# EasyEDA schematic JBCBJSchem.json
TITLE: JBCBJ; REV: 7; Date: 2020-04-20; Sheet: 1/1; Drawn By: SSSI; Company: SSSI
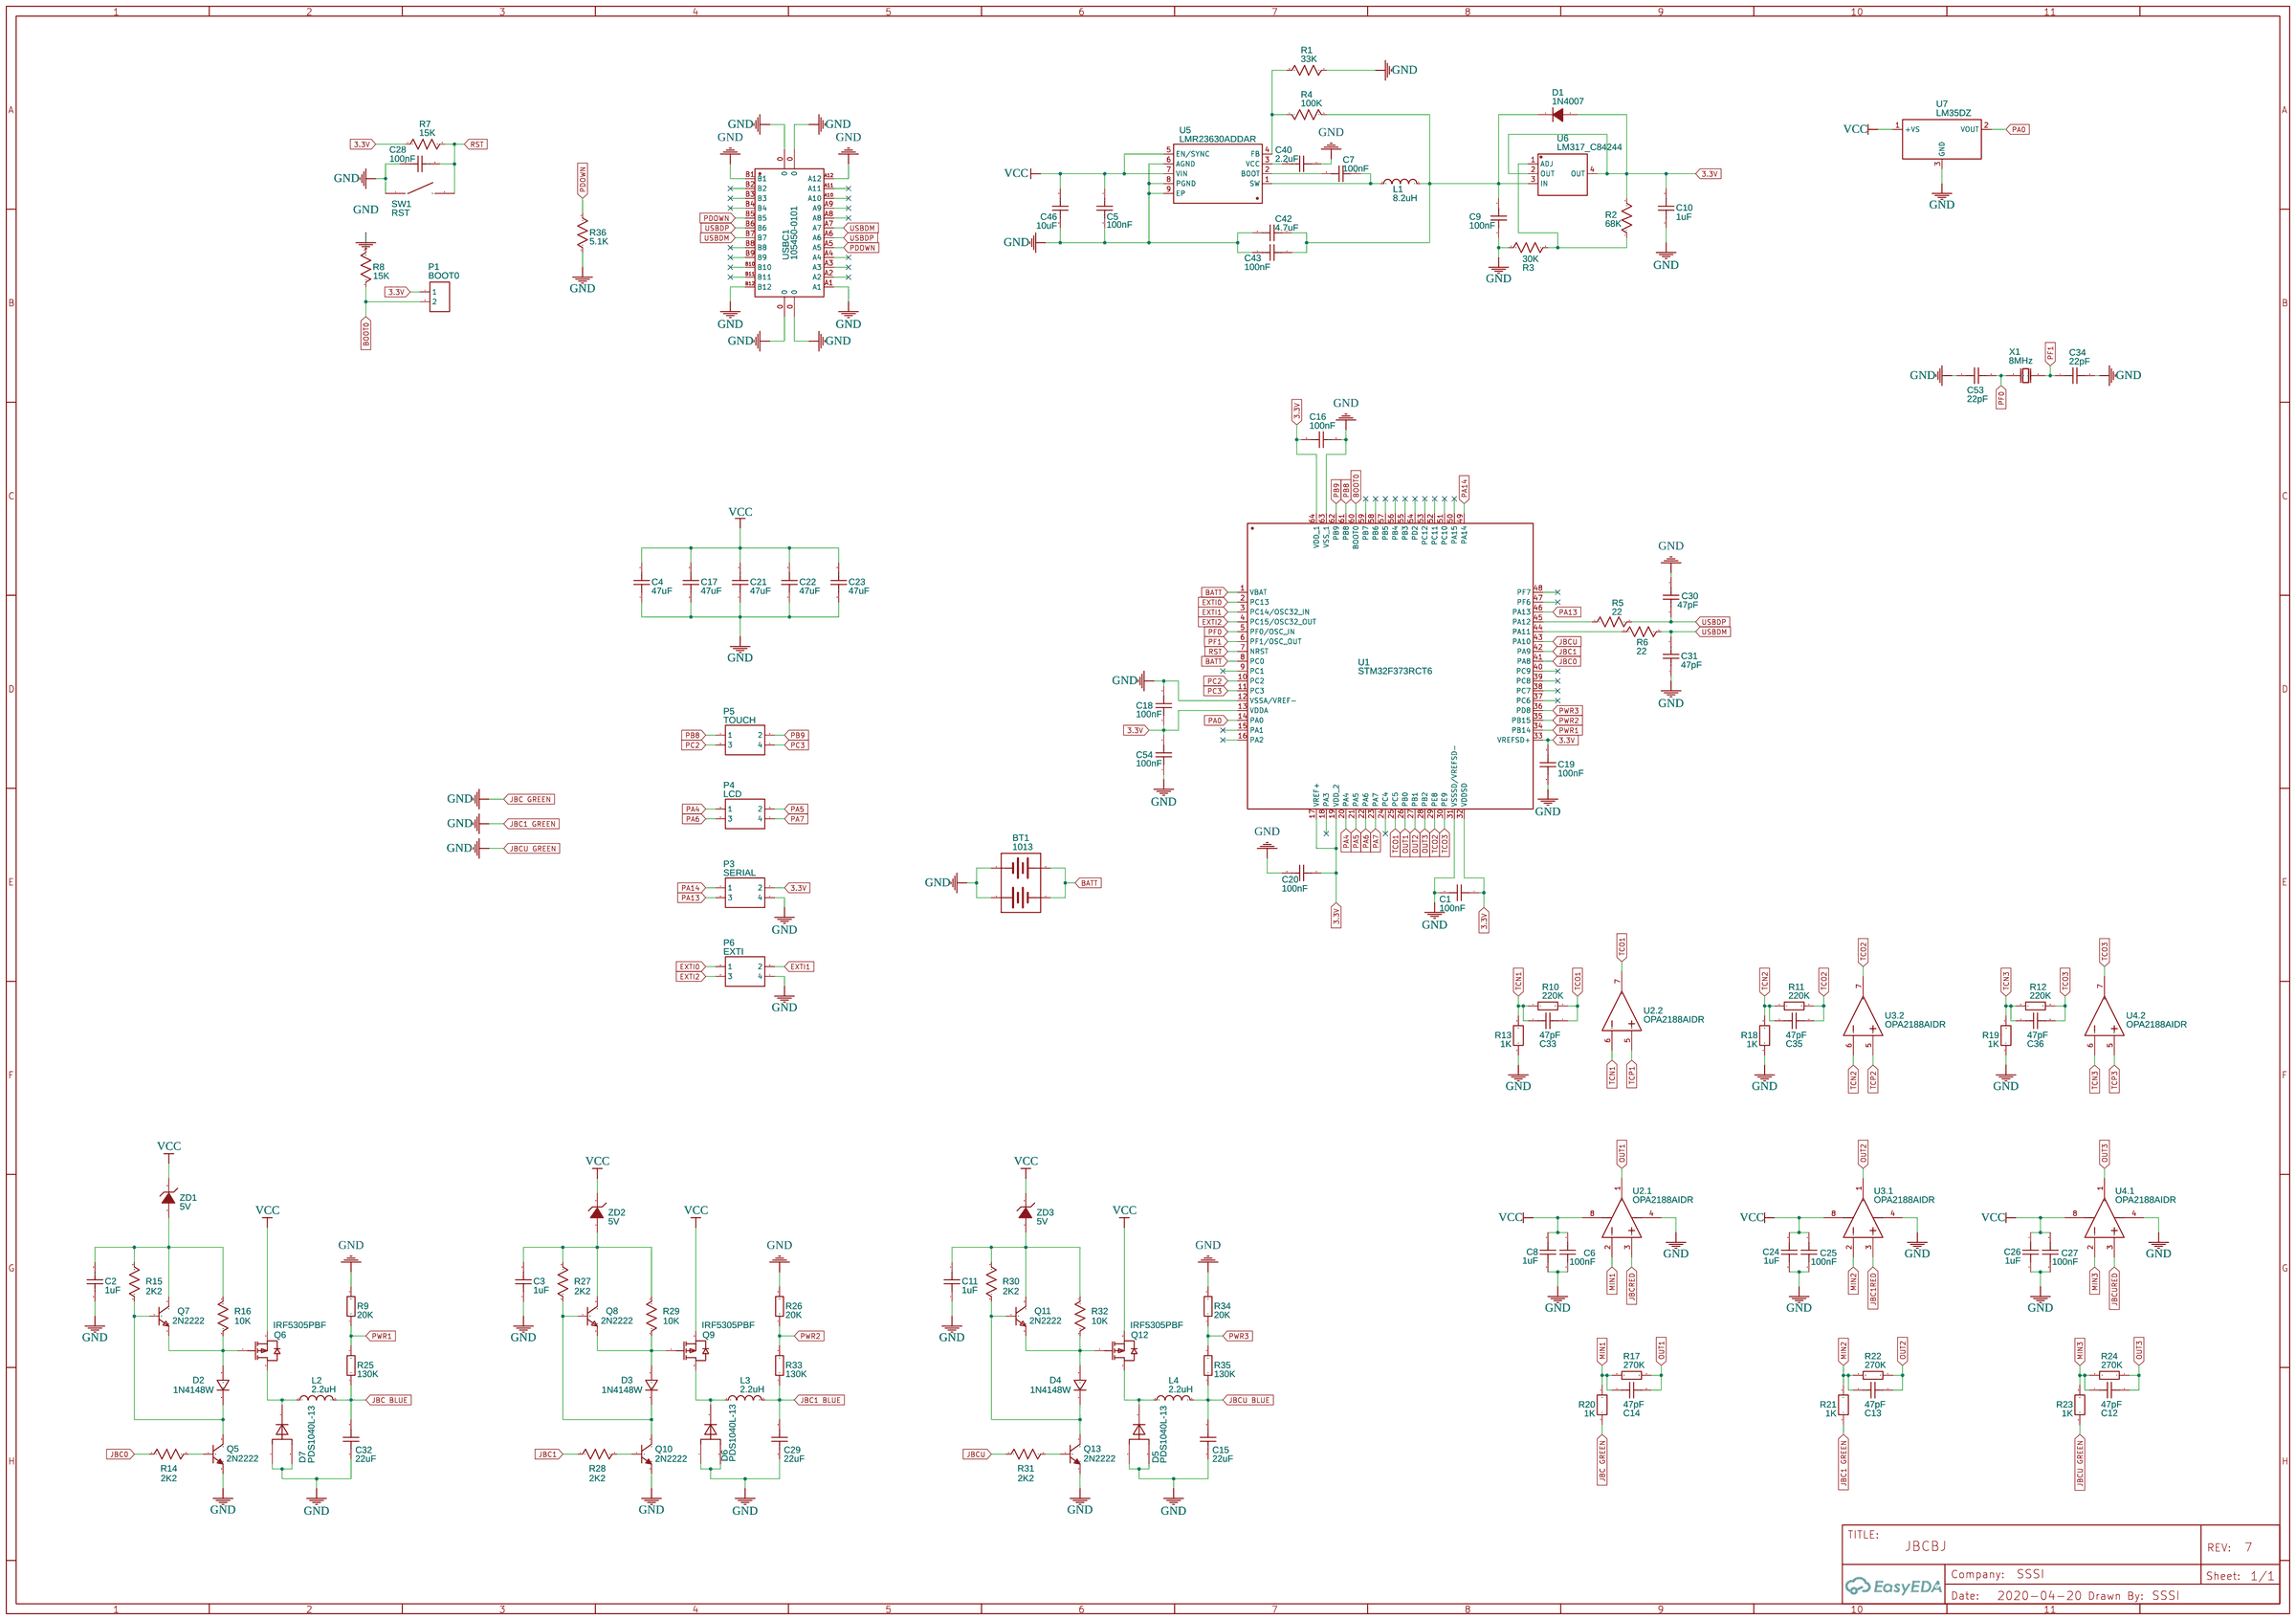
[diagram p0: schematic sheet]

## Parts
BT1  1013  [BAT-TH_KEYSTONE-1013]
C1  100nF  [C0603]
C2  1uF  [C0603]
C3  1uF  [C0603]
C4  47uF  [C1206]
C5  100nF  [C0603]
C6  100nF  [C0603]
C7  100nF  [C0603]
C8  1uF  [C0603]
C9  100nF  [C0603]
C10  1uF  [C0603]
C11  1uF  [C0603]
C12  47pF  [C0603]
C13  47pF  [C0603]
C14  47pF  [C0603]
C15  22uF  [C1206]
C16  100nF  [C0603]
C17  47uF  [C1206]
C18  100nF  [C0603]
C19  100nF  [C0603]
C20  100nF  [C0603]
C21  47uF  [C1206]
C22  47uF  [C1206]
C23  47uF  [C1206]
C24  1uF  [C0603]
C25  100nF  [C0603]
C26  1uF  [C0603]
C27  100nF  [C0603]
C28  100nF  [C0603]
C29  22uF  [C1206]
C30  47pF  [C0603]
C31  47pF  [C0603]
C32  22uF  [C1206]
C33  47pF  [C0603]
C34  22pF  [C0603]
C35  47pF  [C0603]
C36  47pF  [C0603]
C40  2.2uF  [C0603]
C42  4.7uF  [C0603]
C43  100nF  [C0603]
C46  10uF  [C0603]
C53  22pF  [C0603]
C54  100nF  [C0603]
D1  1N4007  [DO-214BA_L4.8-W2.9-LS5.3-RD]
D2  1N4148W  [SOD-323F_L2.0-W1.6-LS2.5-RD]
D3  1N4148W  [SOD-323F_L2.0-W1.6-LS2.5-RD]
D4  1N4148W  [SOD-323F_L2.0-W1.6-LS2.5-RD]
D5  PDS1040L-13  [POWERDI-5_L5.4-W4.0-LS6.5-RD]
D6  PDS1040L-13  [POWERDI-5_L5.4-W4.0-LS6.5-RD]
D7  PDS1040L-13  [POWERDI-5_L5.4-W4.0-LS6.5-RD]
L1  8.2uH  [IND-SMD_L7.8-W7.0_MAPM0630F]
L2  2.2uH  [IND-SMD_L6.6-W6.6_MCW-06XX]
L3  2.2uH  [IND-SMD_L6.6-W6.6_MCW-06XX]
L4  2.2uH  [IND-SMD_L6.6-W6.6_MCW-06XX]
P1  BOOT0  [HDR-TH_2P-P2.54-V-M]
P3  SERIAL  [HDR-TH_4PIN-V-ROW2-COL2-MALE-PITCH2.54]
P4  LCD  [HDR-TH_4PIN-V-ROW2-COL2-MALE-PITCH2.54]
P5  TOUCH  [HDR-TH_4PIN-V-ROW2-COL2-MALE-PITCH2.54]
P6  EXTI  [HDR-TH_4PIN-V-ROW2-COL2-MALE-PITCH2.54]
Q5  2N2222  [SOT-23-3_L2.9-W1.3-P1.90-LS2.4-BR]
Q6  IRF5305PBF  [DPAK-3_L6.6-W6.1-P2.28-LS9.9-BR]
Q7  2N2222  [SOT-23-3_L2.9-W1.3-P1.90-LS2.4-BR]
Q8  2N2222  [SOT-23-3_L2.9-W1.3-P1.90-LS2.4-BR]
Q9  IRF5305PBF  [DPAK-3_L6.6-W6.1-P2.28-LS9.9-BR]
Q10  2N2222  [SOT-23-3_L2.9-W1.3-P1.90-LS2.4-BR]
Q11  2N2222  [SOT-23-3_L2.9-W1.3-P1.90-LS2.4-BR]
Q12  IRF5305PBF  [DPAK-3_L6.6-W6.1-P2.28-LS9.9-BR]
Q13  2N2222  [SOT-23-3_L2.9-W1.3-P1.90-LS2.4-BR]
R1  33K  [R0603]
R2  68K  [R0603]
R3  30K  [R0603]
R4  100K  [R0603]
R5  22  [R0603]
R6  22  [R0603]
R7  15K  [R0603]
R8  15K  [R0603]
R9  20K  [R0603]
R10  220K  [R0603]
R11  220K  [R0603]
R12  220K  [R0603]
R13  1K  [R0603]
R14  2K2  [R0603]
R15  2K2  [R0603]
R16  10K  [R0603]
R17  270K  [R0603]
R18  1K  [R0603]
R19  1K  [R0603]
R20  1K  [R0603]
R21  1K  [R0603]
R22  270K  [R0603]
R23  1K  [R0603]
R24  270K  [R0603]
R25  130K  [R0603]
R26  20K  [R0603]
R27  2K2  [R0603]
R28  2K2  [R0603]
R29  10K  [R0603]
R30  2K2  [R0603]
R31  2K2  [R0603]
R32  10K  [R0603]
R33  130K  [R0603]
R34  20K  [R0603]
R35  130K  [R0603]
R36  5.1K  [R0603]
SW1  RST  [KEY-6.0*6.0-4]
U1  STM32F373RCT6  [LQFP-64_L10.0-W10.0-P0.50-LS12.0-TL]
U2  OPA2188AIDR  [SOIC-8_L4.9-W3.9-P1.27-LS6.0-BL]  (sections 1,2)
U3  OPA2188AIDR  [SOIC-8_L4.9-W3.9-P1.27-LS6.0-BL]  (sections 1,2)
U4  OPA2188AIDR  [SOIC-8_L4.9-W3.9-P1.27-LS6.0-BL]  (sections 1,2)
U5  LMR23630ADDAR  [SO-8_L4.9-W3.9-P1.27-LS6.0-BL-EP]
U6  LM317_C84244  [SOT-223-3_L6.5-W3.4-P2.30-LS7.0-BR]
U7  LM35DZ  [TO-92-3_L4.9-W3.7-P1.27-L]
USBC1  105450-0101  [USB-C-SMD_TYPE-C-USB-18]
X1  8MHz  [HC-49US_L11.5-W4.5-P4.88]
ZD1  5V  [VERTICAL DO41 DIODE]
ZD2  5V  [VERTICAL DO41 DIODE]
ZD3  5V  [VERTICAL DO41 DIODE]

## Library data of the parts
BT1 = 1013: Supplier: LCSC; Supplier Part: C238059; Manufacturer: Keystone; Contributor: LCSC
C1 C5-C10 C12-C14 C16 C18-C20 C24-C28 C30 C31 C33-C36 C40 C42 C43 C46 C53 C54 = Cap_RAD-0.1_US
C2-C4 C11 C17 C21-C23 = C_0201_US: Contributor: LCEDA_Lib
C15 C29 C32 = C3216X5R1V226MTJ00E: Supplier: LCSC; Supplier Part: C342620; Manufacturer: TDK; Contributor: LCSC
D1 = 1N4007: Supplier: LCSC; Manufacturer: SEMTECH; Supplier Part: C106903
D2-D4 = 1N4148W: Supplier: LCSC; Manufacturer: Tak Cheong; Contributor: LCEDA_Lib; Supplier Part: C129216
D5-D7 = PDS1040L-13: Supplier Part: C154714; Supplier: LCSC; Manufacturer: DIODES; Contributor: LCSC
L1 = MAPM0630F-8R2M-LF: Supplier: LCSC; Supplier Part: C280926; Manufacturer: microgate; Contributor: LCSC
L2-L4 = MCW-0630-2R2-S1: Supplier: LCSC; Manufacturer: Hk-hotline; Contributor: LCSC; Supplier Part: C169317
P1 = Header-Female-2.54_1x2: Supplier: LCSC; Manufacturer: BOOMELE; Manufacturer Part: 2.54-1*2PFemale; image: //image.lceda.cn/szlcsc/C49661.jpg; Supplier Part: C49661
P3-P6 = Header-Male-2.54_2x2: Supplier: LCSC; Manufacturer: BOOMELE; Manufacturer Part: Double Rows2.54mm2*2pHeaders  Pins; Supplier Part: C66690
Q5 Q10 Q13 = 2N3904: Supplier: LCSC; Manufacturer: SEMTECH; Supplier Part: C118538
Q6 Q9 Q12 = IRF5305PBF: Supplier: LCSC; Manufacturer: IR; image: //image.lceda.cn/szlcsc/C2623.jpg; Supplier Part: C2623
Q7 Q8 Q11 = 2N2222: Supplier: LCSC; Manufacturer: SEMTECH; Contributor: LCSC; Supplier Part: C118536
R1-R8 R16 R29 R32 R36 = Res_AXIAL-0.3(1/8W)_US
R9 R26 R34 = ERA-3AEB203V: Supplier: LCSC; Supplier Part: C190611; Manufacturer: PANASONIC; Contributor: LCSC
R10-R12 = PTFR0603B220KP9: Supplier: LCSC; Supplier Part: C351667; Manufacturer: ResistorToday; Contributor: LCSC
R13 R18-R21 R23 = PTFR0603B1K00N9: Supplier: LCSC; Supplier Part: C394536; Manufacturer: ResistorToday; Contributor: LCSC
R14 R15 R27 R28 R30 R31 = R_0201_US: Contributor: LCEDA_Lib
R17 R22 R24 = PTFR0805B270KN9: Supplier: LCSC; Supplier Part: C351588; Manufacturer: ResistorToday; Contributor: LCSC
R25 R33 R35 = PTFR0603B130KP9: Supplier: LCSC; Supplier Part: C351684; Manufacturer: ResistorToday; Contributor: LCSC
SW1 = EVQ22705R: Supplier: LCSC; Manufacturer: PANASONIC; Contributor: LCSC; Supplier Part: C79156
U1 = STM32F373RCT6: Supplier: LCSC; Manufacturer: STMicroelectronics; Supplier Part: C84174; LCSC Assembly: Yes; SMT Type: Extend
U2-U4 = OPA2188AIDR: tags: Precision Operational Amplifier; Supplier Part: C17271; Supplier: LCSC; Manufacturer: TI; subpart_no: 1; image: http://image.lceda.cn/szlcsc/C17271.jpg
U5 = LMR23630ADDAR: Supplier: LCSC; Supplier Part: C477923; Manufacturer: Texas Instruments; Contributor: LCSC
U6 = LM317_C84244: Supplier: LCSC; Manufacturer: CJ; Manufacturer Part: LM317; Supplier Part: C84244; LCSC Assembly: Yes; SMT Type: Extend
U7 = LM35DZ: Supplier: LCSC; Manufacturer: TI; image: //image.lceda.cn/szlcsc/C12165.jpg; Supplier Part: C12165
USBC1 = 105450-0101: Supplier: LCSC; Supplier Part: C134092; Manufacturer: MOLEX; Contributor: LCSC
X1 = X49SD8MSB2SI: Supplier: LCSC; Supplier Part: C188205; Manufacturer: Yangxing Tech; Contributor: LCSC
ZD1-ZD3 = BZX84C5V1: Supplier: LCSC; Manufacturer: CJ; image: //image.lceda.cn/szlcsc/C27131.jpg; Supplier Part: C27131; LCSC Assembly: Yes; SMT Type: Extend

## Nets
3.3V: C1.1 C10.2 C16.1 C18.1 C19.1 C20.1 C54.2 D1.2(A) P1.1 P3.2 R2.2 R7.1 U1.13(VDDA) U1.17(VREF+) U1.19(VDD_2) U1.32(VDDSD) U1.33(VREFSD+) U1.64(VDD_1) U6.2(OUT) U6.4(OUT)
GND: BT1.1(P1) BT1.4(N2) C1.2 C2.1 C3.1 C4.1 C5.2 C6.2 C8.2 C9.1 C10.1 C11.1 C15.1 C16.2 C17.1 C18.2 C19.2 C20.2 C21.1 C22.1 C23.1 C24.2 C25.2 C26.2 C27.2 C28.1 C29.1 C30.1 C31.1 C32.1 C34.2 C40.1 C42.2 C43.2 C46.2 C53.1 C54.1 D5.1 D5.2 D6.1 D6.2 D7.1 D7.2 P3.4 P6.4 Q5.2(E) Q10.2(E) Q13.2(E) R1.1 R3.2 R8.2 R9.2 R13.1 R18.1 R19.1 R20.1 R21.1 R23.1 R26.2 R34.2 R36.1 SW1.1 U1.12(VSSA/VREF-) U1.31(VSSSD/VREFSD-) U1.63(VSS_1) U2.4(V-) U3.4(V-) U4.4(V-) U5.6(AGND) U5.8(PGND) U5.9(EP) U7.3(GND) USBC1.0 USBC1.A1 USBC1.A12 USBC1.B1 USBC1.B12
VCC: C4.2 C5.1 C6.1 C8.1 C17.2 C21.2 C22.2 C23.2 C24.1 C25.1 C26.1 C27.1 C46.1 Q6.3(S) Q9.3(S) Q12.3(S) U2.8(V+) U3.8(V+) U4.8(V+) U5.5(EN/SYNC) U5.7(VIN) U7.1(+VS) ZD1.2(K) ZD2.2(K) ZD3.2(K)
BATT: BT1.2(N1) BT1.3(P2) U1.1(VBAT) U1.8(PC0)
BOOT0: P1.2 R8.1 U1.60(BOOT0)
EXTI0: P6.1 U1.2(PC13)
EXTI1: P6.2 U1.3(PC14/OSC32_IN)
EXTI2: P6.3 U1.4(PC15/OSC32_OUT)
JBC0: R14.1 U1.41(PA8)
JBC1: R28.1 U1.42(PA9)
JBC1 BLUE: C29.2 L3.2 R33.1
JBC1RED: U3.3(IN A+)
JBC BLUE: C32.2 L2.2 R25.1
JBCRED: U2.3(IN A+)
JBCU: R31.1 U1.43(PA10)
JBCU BLUE: C15.2 L4.2 R35.1
JBCURED: U4.3(IN A+)
MIN1: C14.1 R17.2 R20.2 U2.2(IN A-)
MIN2: C13.1 R21.2 R22.2 U3.2(IN A-)
MIN3: C12.1 R23.2 R24.2 U4.2(IN A-)
OUT1: C14.2 R17.1 U1.26(PB0) U2.1(OUT A)
OUT2: C13.2 R22.1 U1.27(PB1) U3.1(OUT A)
OUT3: C12.2 R24.1 U1.28(PB2) U4.1(OUT A)
PA0: U1.14(PA0) U7.2(VOUT)
PA4: P4.1 U1.20(PA4)
PA5: P4.2 U1.21(PA5)
PA6: P4.3 U1.22(PA6)
PA7: P4.4 U1.23(PA7)
PA13: P3.3 U1.46(PA13)
PA14: P3.1 U1.49(PA14)
PB8: P5.1 U1.61(PB8)
PB9: P5.2 U1.62(PB9)
PC2: P5.3 U1.10(PC2)
PC3: P5.4 U1.11(PC3)
PDOWN: R36.2 USBC1.A5 USBC1.B5
PF0: C53.2 U1.5(PF0/OSC_IN) X1.1(OSC1)
PF1: C34.1 U1.6(PF1/OSC_OUT) X1.2(OSC2)
PWR1: R9.1 R25.2 U1.34(PB14)
PWR2: R26.1 R33.2 U1.35(PB15)
PWR3: R34.1 R35.2 U1.36(PD8)
RST: C28.2 R7.2 SW1.2 U1.7(NRST)
TCN1: C33.1 R10.1 R13.2 U2.6(IN B-)
TCN2: C35.1 R11.1 R18.2 U3.6(IN B-)
TCN3: C36.1 R12.1 R19.2 U4.6(IN B-)
TCO1: C33.2 R10.2 U1.25(PC5) U2.7(OUT B)
TCO2: C35.2 R11.2 U1.29(PE8) U3.7(OUT B)
TCO3: C36.2 R12.2 U1.30(PE9) U4.7(OUT B)
TCP1: U2.5(IN B+)
TCP2: U3.5(IN B+)
TCP3: U4.5(IN B+)
USBDM: C31.2 R6.2 USBC1.A7 USBC1.B7
USBDP: C30.2 R5.2 USBC1.A6 USBC1.B6
Net-(C2-2): C2.2 Q7.3(C) R15.2 R16.1 ZD1.1(A)
Net-(C3-2): C3.2 Q8.3(C) R27.2 R29.1 ZD2.1(A)
Net-(C7-1): C7.1 L1.2 U5.1(SW)
Net-(C7-2): C7.2 U5.2(BOOT)
Net-(C9-2): C9.2 C42.1 C43.1 D1.1(K) L1.1 R4.2 U6.3(IN)
Net-(C11-2): C11.2 Q11.3(C) R30.2 R32.1 ZD3.1(A)
Net-(C40-2): C40.2 U5.3(VCC)
Net-(D2-1): D2.1 Q5.3(C) Q7.1(B) R15.1
Net-(D2-2): D2.2 Q6.1(G) Q7.2(E) R16.2
Net-(D3-1): D3.1 Q8.1(B) Q10.3(C) R27.1
Net-(D3-2): D3.2 Q8.2(E) Q9.1(G) R29.2
Net-(D4-1): D4.1 Q11.1(B) Q13.3(C) R30.1
Net-(D4-2): D4.2 Q11.2(E) Q12.1(G) R32.2
Net-(D5-3): D5.3 L4.1 Q12.2(D)
Net-(D6-3): D6.3 L3.1 Q9.2(D)
Net-(D7-3): D7.3 L2.1 Q6.2(D)
Net-(Q5-1): Q5.1(B) R14.2
Net-(Q10-1): Q10.1(B) R28.2
Net-(Q13-1): Q13.1(B) R31.2
Net-(R1-2): R1.2 R4.1 U5.4(FB)
Net-(R2-1): R2.1 R3.1 U6.1(ADJ)
Net-(R5-1): R5.1 U1.45(PA12)
Net-(R6-1): R6.1 U1.44(PA11)

Not connected (* = marked no-connect by the designer): U1 9(PC1) 15(PA1) 16(PA2) 18(PA3) 24(PC4) 37(PC6) 38(PC7) 39(PC8) 40(PC9) 47(PF6) 48(PF7) 50(PA15) 51(PC10) 52(PC11) 53(PC12) 54(PD2) 55(PB3) 56(PB4) 57(PB5) 58(PB6) 59(PB7); USBC1 A2 A3 A4 A8 A9 A10 A11 B2 B3 B4 B8 B9 B10 B11
